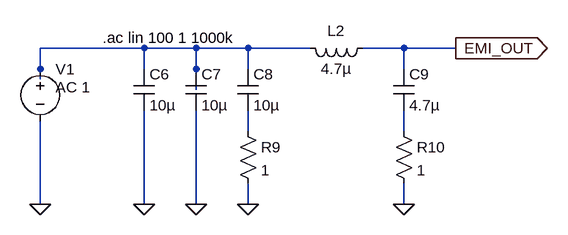
[diagram p0: schematic DAA_EMI_FILTER_simulation.asc]
DAA_EMI_FILTER_simulation.asc, the LTspice schematic file:
Version 4
SHEET 1 880 680
WIRE 128 -240 -32 -240
WIRE 208 -240 128 -240
WIRE 288 -240 208 -240
WIRE 384 -240 288 -240
WIRE 528 -240 464 -240
WIRE 608 -240 528 -240
WIRE -32 -208 -32 -240
WIRE 128 -208 128 -240
WIRE 208 -208 208 -240
WIRE 288 -208 288 -240
WIRE 528 -208 528 -240
WIRE -32 -192 -32 -208
WIRE 208 -176 208 -208
WIRE 288 -112 288 -144
WIRE 528 -112 528 -144
WIRE -32 0 -32 -128
WIRE 128 0 128 -144
WIRE 208 0 208 -144
WIRE 288 0 288 -32
WIRE 528 0 528 -32
FLAG 128 0 0
FLAG 208 0 0
FLAG 288 0 0
FLAG 528 0 0
FLAG -32 0 0
FLAG 608 -240 EMI_OUT
IOPIN 608 -240 Out
SYMBOL cap 112 -208 R0
SYMATTR InstName C6
SYMATTR Value 10µ
SYMATTR SpiceLine V=100
SYMBOL cap 192 -208 R0
SYMATTR InstName C7
SYMATTR Value 10µ
SYMATTR SpiceLine V=100
SYMBOL cap 272 -208 R0
SYMATTR InstName C8
SYMATTR Value 10µ
SYMATTR SpiceLine V=100
SYMBOL cap 512 -208 R0
SYMATTR InstName C9
SYMATTR Value 4.7µ
SYMATTR SpiceLine V=100
SYMBOL res 272 -128 R0
SYMATTR InstName R9
SYMATTR Value 1
SYMATTR SpiceLine tol=1 pwr=0.1
SYMBOL res 512 -128 R0
SYMATTR InstName R10
SYMATTR Value 1
SYMATTR SpiceLine tol=1
SYMBOL ind 480 -256 R90
WINDOW 0 5 56 VBottom 2
WINDOW 3 32 56 VTop 2
SYMATTR InstName L2
SYMATTR Value 4.7µ
SYMATTR SpiceLine Ipk=9
SYMBOL voltage -32 -224 R0
WINDOW 123 24 44 Left 2
WINDOW 39 0 0 Left 0
SYMATTR InstName V1
SYMATTR Value ""
SYMATTR Value2 AC 1
TEXT 64 -256 Left 2 !.ac lin 100 1 1000k

The netlist it stands for:
* DAA_EMI_FILTER_simulation.asc
C6 N001 0 10µ V=100
C7 N001 0 10µ V=100
C8 N001 N002 10µ V=100
C9 EMI_OUT N003 4.7µ V=100
R9 N002 0 1 tol=1 pwr=0.1
R10 N003 0 1 tol=1
L2 EMI_OUT N001 4.7µ Ipk=9
V1 N001 0 AC 1
.ac lin 100 1 1000k
.backanno
.end